# Altium schematic sheet MCU.SchDoc: MCU
size A4; Date: 22/04/2023; ApprovedBy: Douglas Felipe; Author: Douglas Felipe; DocumentNumber: GERABS01; Revision: 1.0; SheetNumber: 5; SheetTotal: 5; Application_BuildNumber: 1.0
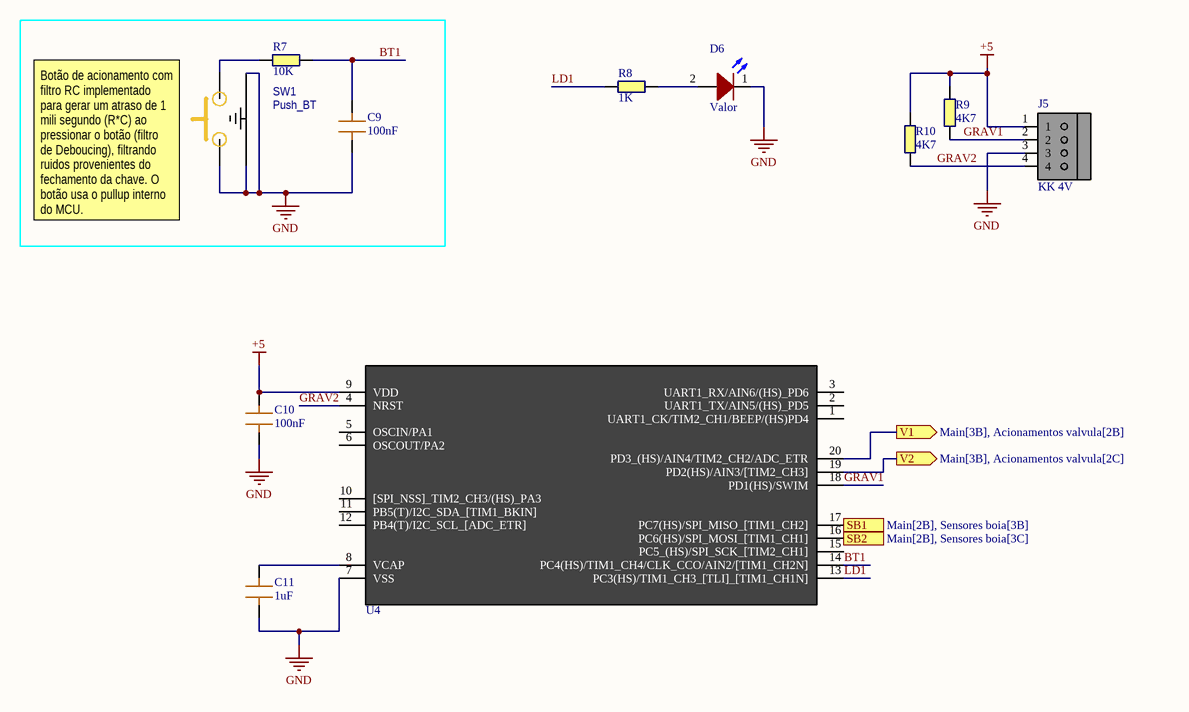
[diagram p0: MCU.SchDoc]

## Parts
C9  100nF  [Capacitor 0805]
C10  100nF  [Capacitor 0805]
C11  1uF  [Capacitor 0805]
D6  Valor  [LED 3MM]
J5  KK 4V  [CONN KK 4 VIAS]
R7  10K  [RESISTOR 1/4W 0805]
R8  1K  [RESISTOR 1/4W 0805]
R9  4K7  [RESISTOR 1/4W 0805]
R10  4K7  [RESISTOR 1/4W 0805]
SW1  Push_BT  [SWITCH 9.5 180]
U4  STM8S003F3P6  [SOP65P640X170-20N]  (value not drawn)

## Ports
SB1 (in, see Main[2B], Sensores boia[3B]), SB2 (in, see Main[2B], Sensores boia[3C]), V1 (out, see Main[3B], Acionamentos valvula[2B]), V2 (out, see Main[3B], Acionamentos valvula[2C])

## Nets
+5: C10.1 J5.1 R9.1 R10.2 U4.9(VDD)
GND: C9.2 C10.2 C11.1 D6.1 J5.3 SW1.1 SW1.3 SW1.4 U4.7(VSS)
BT1: C9.1 R7.1 U4.14(PC4(HS)/TIM1_CH4/CLK_CCO/AIN2/[TIM1_CH2N])
GRAV1: J5.2 R9.2 U4.18(PD1(HS)/SWIM)
GRAV2: J5.4 R10.1 U4.4(NRST)
LD1: R8.2 U4.13(PC3(HS)/TIM1_CH3_[TLI]_[TIM1_CH1N])
SB1: U4.17(PC7(HS)/SPI_MISO_[TIM1_CH2]) ; port SB1
SB2: U4.16(PC6(HS)/SPI_MOSI_[TIM1_CH1]) ; port SB2
V1: U4.20(PD3_(HS)/AIN4/TIM2_CH2/ADC_ETR) ; port V1
V2: U4.19(PD2(HS)/AIN3/[TIM2_CH3]) ; port V2
NetC11_2: C11.2 U4.8(VCAP)
NetD6_2: D6.2 R8.1
NetR7_2: R7.2 SW1.2

Not connected (* = marked no-connect by the designer): U4 1(UART1_CK/TIM2_CH1/BEEP/(HS)PD4) 2(UART1_TX/AIN5/(HS)_PD5) 3(UART1_RX/AIN6/(HS)_PD6) 5(OSCIN/PA1) 6(OSCOUT/PA2) 10([SPI_NSS]_TIM2_CH3/(HS)_PA3) 11(PB5(T)/I2C_SDA_[TIM1_BKIN]) 12(PB4(T)/I2C_SCL_[ADC_ETR]) 15(PC5_(HS)/SPI_SCK_[TIM2_CH1])

## Notes on the sheet
- (near SW1) Botão de acionamento com filtro RC implementado para gerar um atraso de 1 mili segundo (R*C) ao pressionar o botão (filtro de Deboucing), filtrando ruidos provenientes do fechamento da chave. O botão usa o pullup interno do MCU.
- PROJETO
- REV
- TITULO
- PÁG
- DE
- NÚMERO
- DESIGNER
- REVISADO POR
- DATA
- ARQUIVO
- TAMANHO
- A4

## Library data of the parts
C9-C11 = CAPACITOR: Published: 8-Jun-2000; LatestRevisionDate: 17-Jul-2002; LatestRevisionNote: Re-released for DXP Platform.; PackageReference: RAD-0.3; Publisher: Altium Limited; PackageDescription: Radial Cap, Thru-Hole; 2 Leads; 0.3 in Pin Spacing
D6 = LED: Typical RED, GREEN, YELLOW, AMBER GaAs LED; Published: 8-Jun-2000; LatestRevisionDate: 17-Jul-2002; LatestRevisionNote: Re-released for DXP Platform.; PackageVersion: Feb-2002; PackageReference: 3.2X1.6X1.1; Publisher: Altium Limited; PackageDescription: SM LED; 2 Flat Leads
J5 = KK 4 vias
R7-R10 = RESISTOR 1/4W: Resistor; Published: 8-Jun-2000; LatestRevisionDate: 17-Jul-2002; LatestRevisionNote: Re-released for DXP Platform.; PackageReference: AXIAL-0.4; Publisher: Altium Limited; PackageDescription: Axial Device, Thru-Hole; 2 Leads; 0.4 in Pin Spacing
U4 = STM8S003F3P6: STMICROELECTRONICS - STM8S003F3P6 - MCU, 8BIT, STM8, 16MHZ, TSSOP-20; Geometry.Height: 1.2mm; Mouser Part Number: 511-STM8S003F3P6; Mouser Price/Stock: https://www.mouser.co.uk/ProductDetail/STMicroelectronics/STM8S003F3P6?qs=vV0pr1uq7fD%252BGii5YhjnYw%3D%3D; Manufacturer_Name: STMicroelectronics; Manufacturer_Part_Number: STM8S003F3P6; Datasheet Link: http://www.st.com/web/en/resource/technical/document/datasheet/DM00024550.pdf